# Altium schematic sheet TDisplay.SchDoc: LiveDesign Evaluation - Stop Watch
size A4; Organization: Altium Limited; Address1: L3, 12a Rodborough Rd; Address2: Frenchs Forest; Address3: NSW; Address4: Australia 2086; DocumentNumber: 3; SheetNumber: 3; SheetTotal: 7
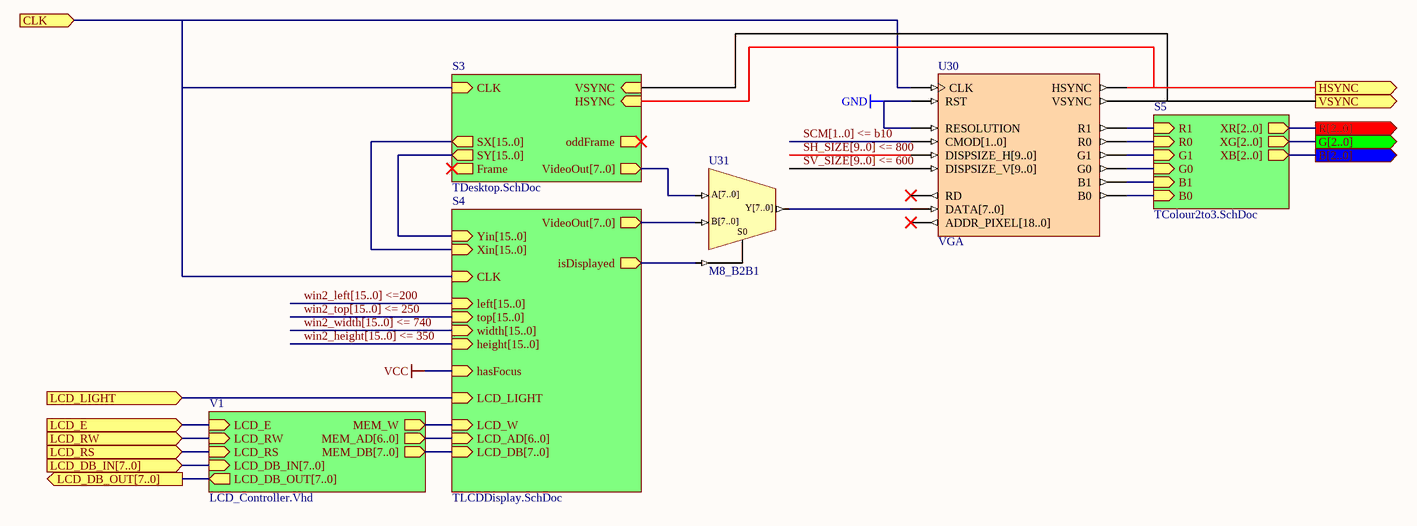
[diagram p0: TDisplay.SchDoc]

## Parts
U30  VGA
U31  M8_B2B1

## Sub-sheets
S3 = TDesktop.SchDoc: CLK (in), VideoOut[7..0] (out), SX[15..0] (out), SY[15..0] (out), HSYNC (in), VSYNC (in), Frame (out), oddFrame (out)
S4 = TLCDDisplay.SchDoc: CLK (in), VideoOut[7..0] (out), Xin[15..0] (in), Yin[15..0] (in), top[15..0] (in), width[15..0] (in), height[15..0] (in), left[15..0] (in), isDisplayed (out), hasFocus (in), LCD_LIGHT (in), LCD_W (in), LCD_AD[6..0] (in), LCD_DB[7..0] (in)
S5 = TColour2to3.SchDoc: XR[2..0] (out), XG[2..0] (out), XB[2..0] (out), R1 (in), R0 (in), G1 (in), G0 (in), B1 (in), B0 (in)
V1 = LCD_Controller.Vhd: LCD_E (in), LCD_RW (in), LCD_RS (in), LCD_DB_IN[7..0] (in), MEM_W (out), MEM_AD[6..0] (out), MEM_DB[7..0] (out), LCD_DB_OUT[7..0] (out)

## Ports
B[2..0] (out), CLK (in), G[2..0] (out), HSYNC (out), LCD_DB_IN[7..0] (in), LCD_DB_OUT[7..0] (out), LCD_E (in), LCD_LIGHT (in), LCD_RS (in), LCD_RW (in), R[2..0] (out), VSYNC (out)

## Nets
GND: U30.RESOLUTION U30.RST
VCC: sheet S4/hasFocus
CLK: U30.CLK ; port CLK, sheet S3/CLK, sheet S4/CLK
HSYNC: U30.HSYNC ; port HSYNC, sheet S3/HSYNC
LCD_E: port LCD_E, sheet V1/LCD_E
LCD_LIGHT: port LCD_LIGHT, sheet S4/LCD_LIGHT
LCD_RS: port LCD_RS, sheet V1/LCD_RS
LCD_RW: port LCD_RW, sheet V1/LCD_RW
SCM[1..0] <= b10: U30.CMOD[1..0]
SH_SIZE[9..0] <= 800: U30.DISPSIZE_H[9..0]
SV_SIZE[9..0] <= 600: U30.DISPSIZE_V[9..0]
VSYNC: U30.VSYNC ; port VSYNC, sheet S3/VSYNC
NetU30_B0: U30.B0 ; sheet S5/B0
NetU30_B1: U30.B1 ; sheet S5/B1
NetU30_DATA[7..0]: U30.DATA[7..0] U31.Y[7..0]
NetU30_G0: U30.G0 ; sheet S5/G0
NetU30_G1: U30.G1 ; sheet S5/G1
NetU30_R0: U30.R0 ; sheet S5/R0
NetU30_R1: U30.R1 ; sheet S5/R1
NetU31_A[7..0]: U31.A[7..0] ; sheet S3/VideoOut[7..0]
NetU31_B[7..0]: U31.B[7..0] ; sheet S4/VideoOut[7..0]
NetU31_S0: U31.S0 ; sheet S4/isDisplayed
(unnamed): sheet S4/LCD_W, sheet V1/MEM_W

Not connected (* = marked no-connect by the designer): U30 ADDR_PIXEL[18..0]* RD*

## Buses and harness runs
bus port B[2..0] = sheet S5/XB[2..0]
bus port G[2..0] = sheet S5/XG[2..0]
bus port LCD_DB_IN[7..0] = sheet V1/LCD_DB_IN[7..0]
bus port LCD_DB_OUT[7..0] = sheet V1/LCD_DB_OUT[7..0]
bus port R[2..0] = sheet S5/XR[2..0]
bus SCM[1..0] <= b10
bus SH_SIZE[9..0] <= 800
bus sheet S3/SX[15..0] = sheet S4/Xin[15..0]
bus sheet S3/SY[15..0] = sheet S4/Yin[15..0]
bus sheet S4/LCD_AD[6..0] = sheet V1/MEM_AD[6..0]
bus sheet S4/LCD_DB[7..0] = sheet V1/MEM_DB[7..0]
bus SV_SIZE[9..0] <= 600
bus win2_height[15..0] <= 350 = sheet S4/height[15..0]
bus win2_left[15..0] <=200 = sheet S4/left[15..0]
bus win2_top[15..0] <= 250 = sheet S4/top[15..0]
bus win2_width[15..0] <= 740 = sheet S4/width[15..0]

## Notes on the sheet
- Title
- Size:
- Date:
- A4
- Number:
- Time:
- Revision:
- Sheet
- of
- File:

## Library data of the parts
U30 = VGA: VGA Controller; Published: 18/12/2003; Publisher: Altium Hobart Technology Centre; Core Revision: 1.00.00
U31 = M8_B2B1: 2x8-Bit Bus to 1x8-Bit Bus Multiplexer; ArchiveName: GENERIC; VHDLIB_SIM: GENERIC_LIB; Published: 29-Jan-2004; Publisher: Altium Limited; Core Revision: 1.00.00